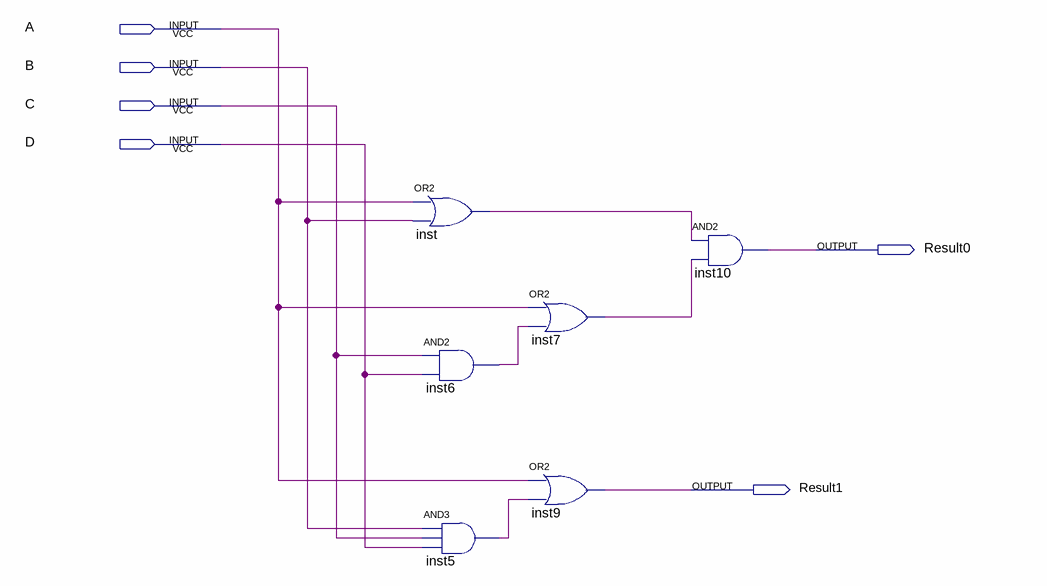
[diagram p0: schematic sheet]
// Quartus schematic LogicCircuitDesignAndExperiment.bdf as structural Verilog: 6 symbols, 6 pins
module LogicCircuitDesignAndExperiment (
  input  A,
  input  B,
  input  C,
  input  D,
  output Result0,
  output Result1
);

  wire inst5_out, inst6_out, inst7_out, inst_out;

  or inst (inst_out, A, B);
  and inst6 (inst6_out, C, D);
  and inst5 (inst5_out, B, C, D);
  or inst7 (inst7_out, A, inst6_out);
  or inst9 (Result1, A, inst5_out);
  and inst10 (Result0, inst_out, inst7_out);
endmodule
